# EAGLE design untitled - Kopia mask (EAGLE 7.4.0)
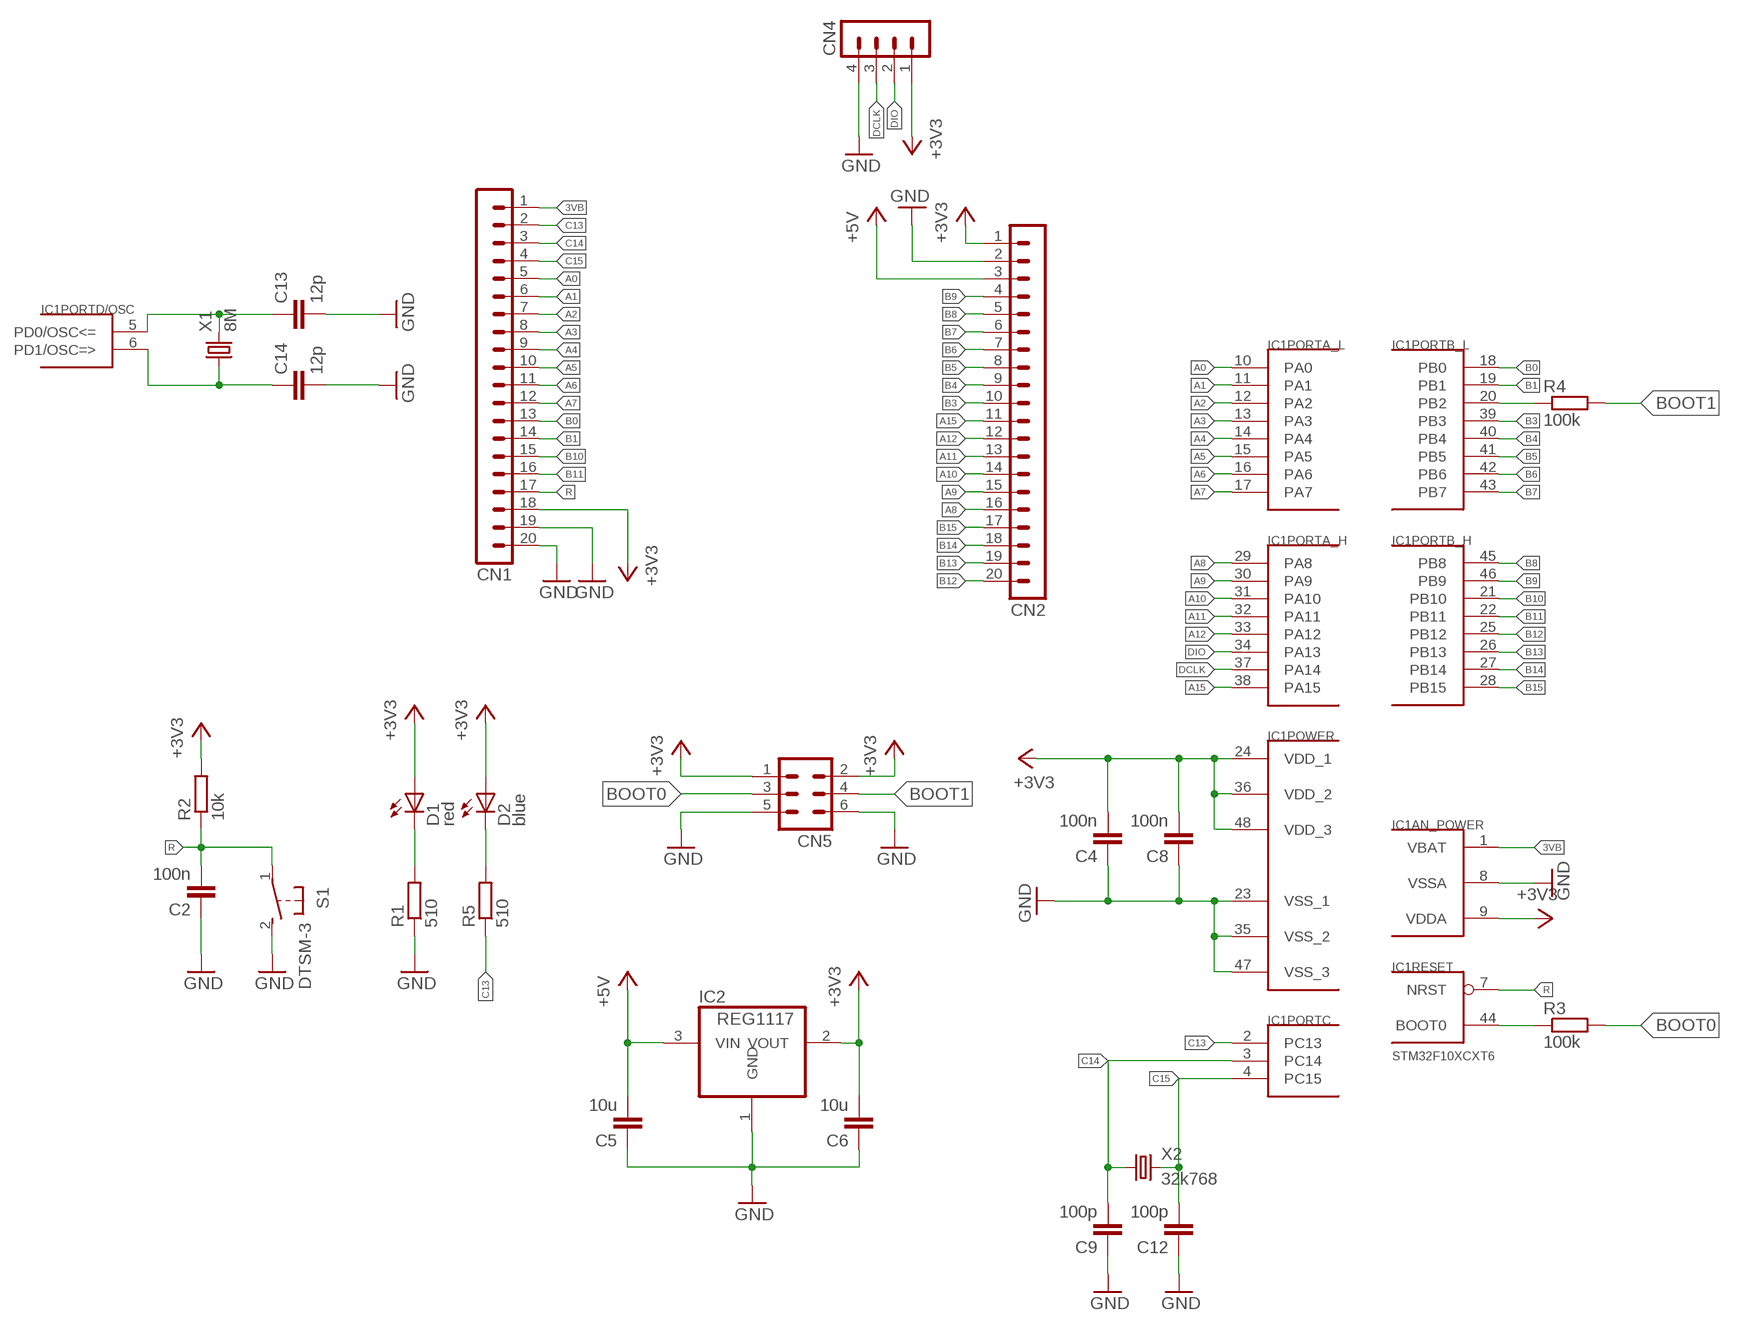
[diagram p0: schematic, sheet 1]

## Parts
C2  100n  C-EUC0805K  [C0805K]
C4  100n  C-EUC0805K  [C0805K]
C5  10u  C-EUC0805K  [C0805K]
C6  10u  C-EUC0805K  [C0805K]
C8  100n  C-EUC0805K  [C0805K]
C9  100p  C-EUC0805K  [C0805K]
C12  100p  C-EUC0805K  [C0805K]
C13  12p  C-EUC0805K  [C0805K]
C14  12p  C-EUC0805K  [C0805K]
CN1  MA20-1L  [MA20-1L]
CN2  MA20-1L  [MA20-1L]
CN4  MA04-1  [MA04-1]
CN5  MA03-2  [MA03-2]
D1  red  LEDSML0805  [SML0805]
D2  blue  LEDSML0805  [SML0805]
IC1  STM32F10XCXT6  [TQFP48]
IC2  REG1117  [SOT223]
R1  510  R-EU_M0805  [M0805]
R2  10k  R-EU_R1206  [R1206]
R3  100k  R-EU_M0805  [M0805]
R4  100k  R-EU_M0805  [M0805]
R5  510  R-EU_M0805  [M0805]
S1  DTSM-3  [DTSM-3]
X1  8M  CRYSTALHC49S  [HC49/S]
X2  32k768  CRYSTALTC26H  [TC26H]

## Nets
3VB: CN1.1 IC1.1(AN_POWER:VBAT)
+3V3: C4.2 C6.2 C8.2 CN1.18 CN2.1 CN4.1 CN5.1 CN5.2 D1.A D2.A IC1.9(AN_POWER:VDDA) IC1.24(POWER:VDD_1) IC1.36(POWER:VDD_2) IC1.48(POWER:VDD_3) IC2.2(VOUT) R2.2
+5V: C5.2 CN2.3 IC2.3(VIN)
_BOOT0: IC1.44(RESET:BOOT0) R3.1
_BOOT1: IC1.20(PORTB_L:PB2) R4.1
A0: CN1.5 IC1.10(PORTA_L:PA0)
A1: CN1.6 IC1.11(PORTA_L:PA1)
A2: CN1.7 IC1.12(PORTA_L:PA2)
A3: CN1.8 IC1.13(PORTA_L:PA3)
A4: CN1.9 IC1.14(PORTA_L:PA4)
A5: CN1.10 IC1.15(PORTA_L:PA5)
A6: CN1.11 IC1.16(PORTA_L:PA6)
A7: CN1.12 IC1.17(PORTA_L:PA7)
A8: CN2.16 IC1.29(PORTA_H:PA8)
A9: CN2.15 IC1.30(PORTA_H:PA9)
A10: CN2.14 IC1.31(PORTA_H:PA10)
A11: CN2.13 IC1.32(PORTA_H:PA11)
A12: CN2.12 IC1.33(PORTA_H:PA12)
A15: CN2.11 IC1.38(PORTA_H:PA15)
B0: CN1.13 IC1.18(PORTB_L:PB0)
B1: CN1.14 IC1.19(PORTB_L:PB1)
B3: CN2.10 IC1.39(PORTB_L:PB3)
B4: CN2.9 IC1.40(PORTB_L:PB4)
B5: CN2.8 IC1.41(PORTB_L:PB5)
B6: CN2.7 IC1.42(PORTB_L:PB6)
B7: CN2.6 IC1.43(PORTB_L:PB7)
B8: CN2.5 IC1.45(PORTB_H:PB8)
B9: CN2.4 IC1.46(PORTB_H:PB9)
B10: CN1.15 IC1.21(PORTB_H:PB10)
B11: CN1.16 IC1.22(PORTB_H:PB11)
B12: CN2.20 IC1.25(PORTB_H:PB12)
B13: CN2.19 IC1.26(PORTB_H:PB13)
B14: CN2.18 IC1.27(PORTB_H:PB14)
B15: CN2.17 IC1.28(PORTB_H:PB15)
BOOT0: CN5.3 R3.2
BOOT1: CN5.4 R4.2
C13: CN1.2 IC1.2(PORTC:PC13) R5.1
C14: C9.2 CN1.3 IC1.3(PORTC:PC14) X2.1
C15: C12.2 CN1.4 IC1.4(PORTC:PC15) X2.2
DCLK: CN4.3 IC1.37(PORTA_H:PA14)
DIO: CN4.2 IC1.34(PORTA_H:PA13)
GND: C2.1 C4.1 C5.1 C6.1 C8.1 C9.1 C12.1 C13.2 C14.2 CN1.19 CN1.20 CN2.2 CN4.4 CN5.5 CN5.6 IC1.8(AN_POWER:VSSA) IC1.23(POWER:VSS_1) IC1.35(POWER:VSS_2) IC1.47(POWER:VSS_3) IC2.1(GND) R1.1 S1.2
N$1: C13.1 IC1.5(PORTD/OSC:PD0/OSC<=) X1.2
N$2: C14.1 IC1.6(PORTD/OSC:PD1/OSC=>) X1.1
N$5: D1.C R1.2
N$6: D2.C R5.2
R: C2.2 CN1.17 IC1.7(RESET:NRST) R2.1 S1.1

## Library data of the parts
C2 C4-C6 C8 C9 C12-C14 = resistor:C-EU: CAPACITOR, European symbol
CN1 CN2 = con-lstb:MA20-1L: PIN HEADER; OC_FARNELL: unknown; OC_NEWARK: unknown
CN4 = con-lstb:MA04-1: PIN HEADER; OC_FARNELL: unknown; OC_NEWARK: unknown
CN5 = con-lstb:MA03-2: PIN HEADER; OC_FARNELL: unknown; OC_NEWARK: unknown
D1 D2 = led:LED: LED OSRAM: - CHIPLED LG R971, LG N971, LY N971, LG Q971, LY Q971, LO R971, LY R971 LH N974, LH R974 LS Q976, LO Q976, LY Q976 LO Q996 - Hyper CHIPLED LW Q18S LB Q993, LB Q99A, LB R99A - SideLED LS A670, LO A670, LY A670, LG A670, LP A670 LB A673, LV A673, LT A673, LW A673 LH A674 LY A675 LS A676, LA A676, LO A676, LY A676, LW A676 LS A679, LY A679, LG A679 - Hyper Micro SIDELED® LS Y876, LA Y876, LO Y876, LY Y876 LT Y87S - SmartLED LW L88C, LW L88S LB L89C, LB L89S, LG L890 LS L89K, LO L89K, LY L89K LS L896, LA L896, LO L896, LY L896 - TOPLED LS T670, LO T670, LY T670, LG T670, LP T670 LSG T670, LSP T670, LSY T670, LOP T670, LYG T670 LG T671, LOG T671, LSG T671 LB T673, LV T673, LT T673, LW T673 LH T674 LS T676, LA T676, LO T676, LY T676, LB T676, LH T676, LSB T676, LW T676 LB T67C, LV T67C, LT T67C, LS T67K, LO T67K, LY T67K, LW E67C LS E67B, LA E67B, LO E67B, LY E67B, LB E67C, LV E67C, LT E67C LW T67C LS T679, LY T679, LG T679 LS T770, LO T770, LY T770, LG T770, LP T770 LB T773, LV T773, LT T773, LW T773 LH T774 LS E675, LA E675, LY E675, LS T675 LS T776, LA T776, LO T776, LY T776, LB T776 LHGB T686 LT T68C, LB T68C - Hyper Mini TOPLED® LB M676 - Mini TOPLED Santana® LG M470 LS M47K, LO M47K, LY M47K Source: http://www.osram.convergy.de LUXEON: - LUMILED® LXK2-PW12-R00, LXK2-PW12-S00, LXK2-PW14-U00, LXK2-PW14-V00 LXK2-PM12-R00, LXK2-PM12-S00, LXK2-PM14-U00 LXK2-PE12-Q00, LXK2-PE12-R00, LXK2-PE12-S00, LXK2-PE14-T00, LXK2-PE14-U00 LXK2-PB12-K00, LXK2-PB12-L00, LXK2-PB12-M00, LXK2-PB14-N00, LXK2-PB14-P00, LXK2-PB14-Q00 LXK2-PR12-L00, LXK2-PR12-M00, LXK2-PR14-Q00, LXK2-PR14-R00 LXK2-PD12-Q00, LXK2-PD12-R00, LXK2-PD12-S00 LXK2-PH12-R00, LXK2-PH12-S00 LXK2-PL12-P00, LXK2-PL12-Q00, LXK2-PL12-R00 Source: www.luxeon.com KINGBRIGHT: KA-3528ASYC Source: www.kingbright.com
IC1 = stm32:STM32F10XCXT6: ST STM32F101/103 48pin LQFP
IC2 = burr-brown:REG1117: 800mA and 1A Low Dropout (LDO) Positive Regulator 1.8V, 2.5V, 2.85V, 3.3V, 5V, and Adj; MPN: REG1117; OC_FARNELL: 1097566; OC_NEWARK: 14P6981
R1-R5 = resistor:R-EU_: RESISTOR, European symbol
S1 = switch-tact:DTSM-3
X1 = crystal:CRYSTAL: CRYSTAL; OC_FARNELL: 1667008; OC_NEWARK: unknown
X2 = crystal:CRYSTAL: CRYSTAL; OC_FARNELL: unknown; OC_NEWARK: unknown

## Board
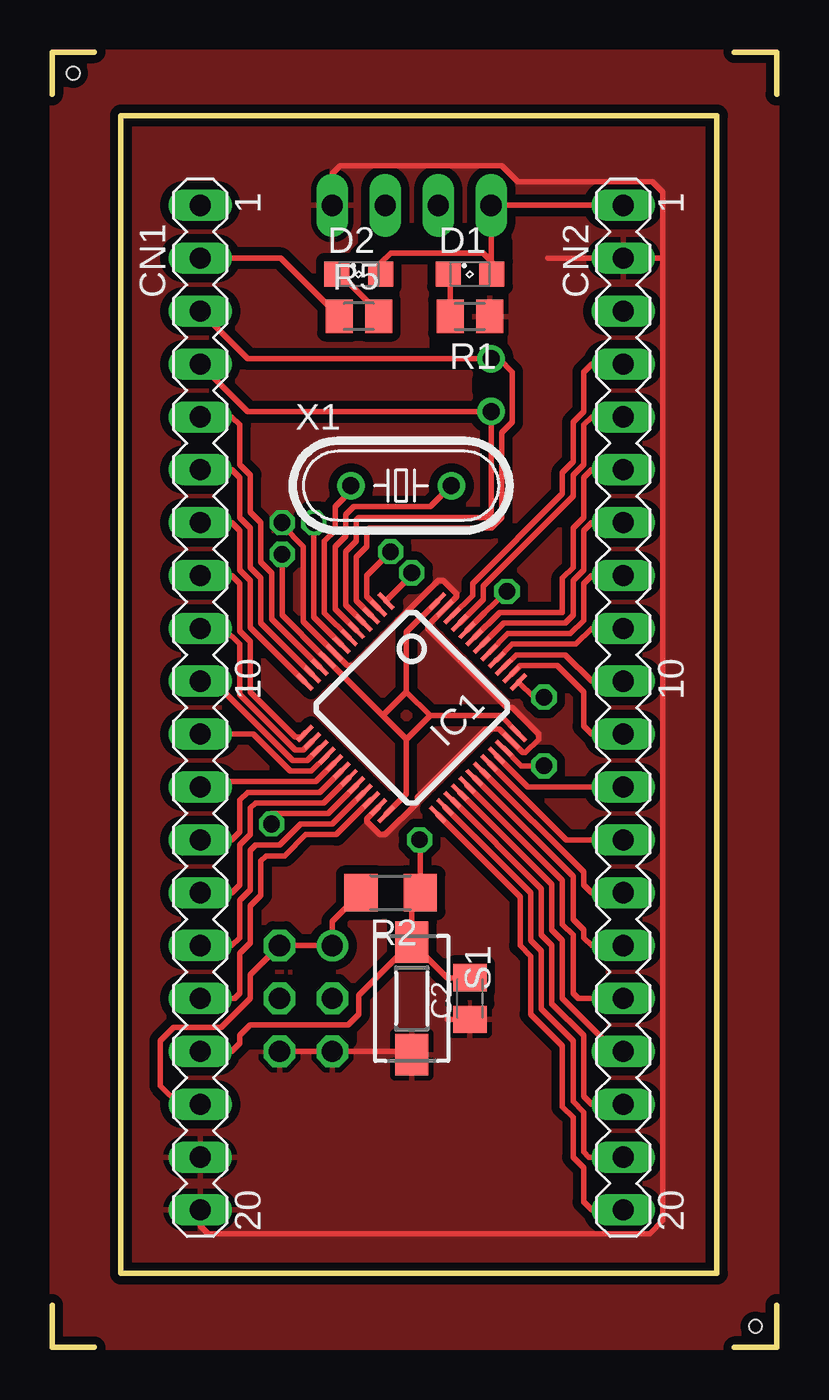
[diagram p1: board, top side]
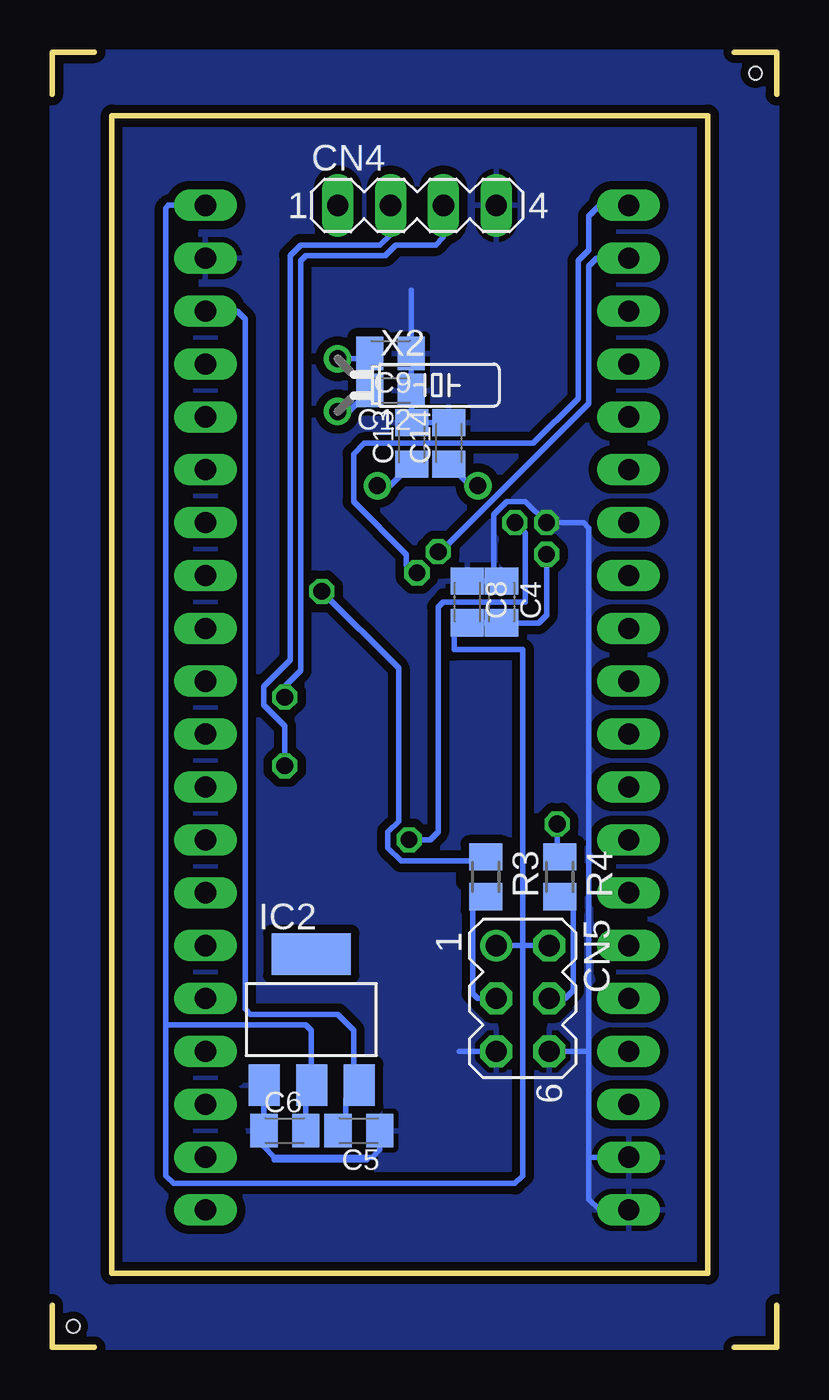
[diagram p2: board, bottom side, seen from below]

Size 34.8 x 62.23 mm. Coordinates in mm from the lower left corner, seen from the top.
Outline: 34.8,2.03 34.8,0 32.77,0
Outline: 34.8,60.2 34.8,62.23 32.77,62.23
Outline: 2.03,62.23 0,62.23 0,60.2
Outline: 0,2.03 0,0 2.03,0
Outline: 3.3,3.56 31.93,3.56 31.93,59.17 3.3,59.17 3.3,3.56
Copper layers (1*16): Top 0.035mm / dielectric 1.5mm / Bottom 0.035mm
Design rules "default *": minimum track width 10mil, minimum drill 24mil, track to track 8mil, track to pad 8mil, pad to pad 8mil, via to via 8mil, smd to smd 8mil, copper to edge 10mil, drill to drill 8mil, minimum pad ring 10mil, minimum via ring 8mil, stop-mask expansion 4mil, vias tented up to drill 0mil, thermal gap 10mil
Holes 0.6 mm at 33.78,1.02 1.02,61.21
tRestrict: area 5.8,13 to 6.1,13.2; area 8.1,18 to 8.4,18.3; area 12.2,16 to 12.4,16.3; area 8.1,20.6 to 8.4,20.8; area 8.1,23.1 to 8.4,23.4; area 8.1,25.7 to 8.4,25.9; area 8.1,33.3 to 8.4,33.5; area 8.1,35.8 to 8.4,36.1; area 8.1,38.4 to 8.4,38.6; area 8.1,40.9 to 8.4,41.1; area 8.1,43.4 to 8.4,43.7; area 26.2,46 to 26.4,46.2; 34 more areas; 4 lines
bRestrict: area 28.7,8.4 to 29,8.6; area 28.7,8.1 to 29,8.4; area 28.7,15 to 29,15.2; area 28.7,15.7 to 29,16; area 25.7,15.7 to 25.9,16; area 25.9,15.7 to 26.2,16; area 25.9,16 to 26.2,16.3; area 9.1,22.4 to 9.4,22.9; area 9.4,22.4 to 9.7,22.9; area 9.7,22.4 to 11.4,22.9; area 13,22.4 to 15,22.9; area 21.1,11.4 to 21.3,13.7; 63 more areas

### Footprints (pad centres in the part's own frame; a part is rotated, then mirrored left to right if it is on the bottom)
C0805K = smd 1.3 x 1.6: 1 -1,0; 2 1,0
MA20-1L = drill 1.016 long: 1 24.13,0; 2 21.59,0; 3 19.05,0; 4 16.51,0; 5 13.97,0; 6 11.43,0; 7 8.89,0; 8 6.35,0; 9 3.81,0; 10 1.27,0; 11 -1.27,0; 12 -3.81,0; 13 -6.35,0; 14 -8.89,0; 15 -11.43,0; 16 -13.97,0; 17 -16.51,0; 18 -19.05,0; 19 -21.59,0; 20 -24.13,0
MA04-1 = drill 1.016 long: 1 -3.81,0; 2 -1.27,0; 3 1.27,0; 4 3.81,0
MA03-2 = drill 1.016: 1 -2.54,-1.27 | drill 1.016 octagon: 2 -2.54,1.27; 3 0,-1.27; 4 0,1.27; 5 2.54,-1.27; 6 2.54,1.27
SML0805 = smd 1.2 x 1.2: A 1.05,0; C -1.05,0
TQFP48 = smd 0.2 x 1: 1 -2.75,-4.5; 2 -2.25,-4.5; 3 -1.75,-4.5; 4 -1.25,-4.5; 5 -0.75,-4.5; 6 -0.25,-4.5; 7 0.25,-4.5; 8 0.75,-4.5; 9 1.25,-4.5; 10 1.75,-4.5; 11 2.25,-4.5; 12 2.75,-4.5; 25 2.75,4.5; 26 2.25,4.5; 27 1.75,4.5; 28 1.25,4.5; 29 0.75,4.5; 30 0.25,4.5; 31 -0.25,4.5; 32 -0.75,4.5; 33 -1.25,4.5; 34 -1.75,4.5; 35 -2.25,4.5; 36 -2.75,4.5 | smd 1 x 0.2: 13 4.5,-2.75; 14 4.5,-2.25; 15 4.5,-1.75; 16 4.5,-1.25; 17 4.5,-0.75; 18 4.5,-0.25; 19 4.5,0.25; 20 4.5,0.75; 21 4.5,1.25; 22 4.5,1.75; 23 4.5,2.25; 24 4.5,2.75; 37 -4.5,2.75; 38 -4.5,2.25; 39 -4.5,1.75; 40 -4.5,1.25; 41 -4.5,0.75; 42 -4.5,0.25; 43 -4.5,-0.25; 44 -4.5,-0.75; 45 -4.5,-1.25; 46 -4.5,-1.75; 47 -4.5,-2.25; 48 -4.5,-2.75
SOT223 = smd 1.499 x 2.007: 1 -2.261,-3.15; 2 0.025,-3.15; 3 2.311,-3.15 | smd 3.81 x 2.007: 4 0,3.15
M0805 = smd 1.3 x 1.6: 1 -0.95,0; 2 0.95,0
R1206 = smd 1.6 x 1.803: 1 -1.422,0; 2 1.422,0
DTSM-3 = smd 2 x 1.6: 1 -2.7,0; 2 2.7,0
HC49/S = drill 0.813: 1 -2.413,0; 2 2.413,0
TC26H = drill 0.813: 1 -1.27,0; 2 1.27,0

### Placement (x,y rotation side)
C2  20.07,16.76 90 top
C4  13.21,35.81 270 bottom
C5  20.07,10.41 180 bottom
C6  23.62,10.41 0 bottom
C8  14.86,35.81 270 bottom
C9  18.54,47.75 180 bottom
C12  18.54,45.97 180 bottom
C13  17.53,43.43 90 bottom
C14  15.75,43.43 90 bottom
CN1  7.11,30.73 90 top
CN2  27.43,30.73 90 top
CN4  17.27,54.86 0 bottom
CN5  12.19,16.76 270 bottom
D1  20.07,51.56 0 top
D2  14.73,51.56 0 top
IC1  17.27,30.73 225 top
IC2  22.35,15.75 0 bottom
R1  20.07,49.53 180 top
R2  16.26,21.84 180 top
R3  13.97,22.61 270 bottom
R4  10.41,22.61 270 bottom
R5  14.73,49.53 0 top
S1  17.27,16.76 270 top
X1  16.76,41.4 0 top
X2  21.08,46.23 270 bottom

### Tracks (layer width: path | path; a pad name or v marks a point on that pad's centre or on a via)
3VB  (via drill 0.8)
  Top 0.254: IC1.1 17.27,37.1 v17.27,37.21
  Bottom 0.254: v17.27,37.21 17.78,37.59 17.78,38.1 20.32,40.64 20.32,42.93 19.81,43.43 11.68,43.43 9.53,45.59 9.53,52.2 9.02,52.7 9.02,54.36 8.51,54.86 CN1.1
+3V3  (via drill 0.8)
  Top 0.254: 15.88,30.36 IC1.9 12.96,33.27 12.95,33.27 11.05,35.18 v11.05,38.1 | 15.88,30.36 17.02,29.22 17.02,29.21 | IC1.48 17.02,34.37 17.02,31.5 | IC1.36 21.54,30.35 18.16,30.35 | IC1.24 17.02,26.59 17.02,29.21 | 17.02,31.5 15.88,30.36 | 17.02,31.5 18.16,30.35 | 18.16,30.35 17.02,29.21 | R2.2 13.46,20.47 CN5.1 CN5.2 9.53,17.91 9.53,16.76 8.13,15.37 5.84,15.37 5.21,14.73 5.21,12.57 6.1,11.68 CN1.18 | D2.A 15.75,51.6 15.75,52.07 16.26,52.58 20.7,52.58 21.12,52.16 D1.A 21.08,51.6 CN4.1 CN2.1
  Bottom 0.254: 12.19,19.3 12.19,33.53 15.49,33.53 15.49,34.8 14.86,34.8 | 12.19,19.3 CN5.2 | 12.7,35.31 13.19,34.81 C4.2 13.83,34.67 13.97,34.81 C8.2 14.86,34.8 | v11.05,38.1 11.05,35.18 11.43,34.8 14.86,34.8 | C6.2 22.62,12.3 IC2.2 22.35,12.62 22.35,15.24 22.61,15.49 29.34,15.49 | 29.34,15.49 29.34,54.74 29.21,54.86 CN2.1 | CN5.1 12.19,19.3 | 12.19,19.3 12.19,8.26 12.57,7.87 28.96,7.87 29.34,8.26 29.34,15.49
+5V
  Bottom 0.254: C5.2 21.07,10.43 20.7,10.79 20.7,11.94 IC2.3 20.32,12.88 20.32,15.24 21.08,16 25.27,16 25.53,16.26 25.53,49.4 25.91,49.78 CN2.3
_BOOT0  (via drill 0.8)
  Top 0.254: IC1.44 20.78,35.31 v21.84,36.32
  Bottom 0.254: v21.84,36.32 18.16,32.64 18.16,25.27 18.67,24.77 18.67,24 18.03,23.37 14.61,23.37 14.42,23.56 R3.1
_BOOT1  (via drill 0.8)
  Top 0.254: IC1.20 13.25,25.65 10.54,25.65 v10.54,25.15
  Bottom 0.254: R4.1 10.54,23.68 v10.54,25.15
A0
  Top 0.254: CN1.5 8.64,44.7 9.02,44.32 9.02,42.42 9.53,41.91 9.53,40.13 10.03,39.62 10.03,37.72 10.54,37.21 10.54,34.99 IC1.10
A1
  Top 0.254: CN1.6 8.64,42.16 9.02,41.78 9.02,39.88 9.53,39.37 9.53,37.47 10.03,36.96 10.03,34.79 IC1.11
A2
  Top 0.254: CN1.7 8.64,39.62 9.02,39.24 9.02,37.34 9.53,36.83 9.53,34.59 IC1.12
A3
  Top 0.254: CN1.8 8.64,37.08 9.02,36.7 9.02,34.42 9.53,33.91 9.53,31.5 11.68,29.34 11.97,29.34 12.15,29.51 IC1.13
A4
  Top 0.254: IC1.14 12.06,28.7 11.68,28.7 9.02,31.37 9.02,33.78 8.26,34.54 CN1.9
A5
  Top 0.254: IC1.15 12.26,28.19 11.56,28.19 7.75,32 CN1.10
A6
  Top 0.254: IC1.16 12.46,27.69 11.43,27.69 9.65,29.46 CN1.11
A7
  Top 0.254: IC1.17 12.66,27.18 7.75,27.18 7.49,26.92 CN1.12
A8
  Top 0.254: IC1.29 24.51,22.43 24.51,20.32 25.02,19.81 25.02,17.02 25.27,16.76 CN2.16
A9
  Top 0.254: IC1.30 25.02,22.63 25.02,20.57 25.53,20.07 25.53,19.68 25.91,19.3 CN2.15
A10
  Top 0.254: IC1.31 25.53,22.83 25.53,22.23 25.91,21.84 CN2.14
A11
  Top 0.254: IC1.32 24.68,24.38 CN2.13
A12
  Top 0.254: IC1.33 22.85,26.92 CN2.12
A15
  Top 0.254: IC1.38 22.49,32.77 24.26,32.77 25.53,31.5 25.53,29.85 25.91,29.46 CN2.11
B0
  Top 0.254: IC1.18 12.85,26.67 9.4,26.67 9.02,26.29 9.02,24.77 8.64,24.38 CN1.13
B1
  Top 0.254: IC1.19 13.05,26.16 9.78,26.16 9.53,25.91 9.53,24.64 9.02,24.13 9.02,22.23 8.64,21.84 CN1.14
B3
  Top 0.254: IC1.39 22.29,33.27 24.64,33.27 25.91,32 CN2.10
B4
  Top 0.254: CN2.9 25.91,34.54 25.15,33.78 22.1,33.78 IC1.40
B5
  Top 0.254: IC1.41 21.89,34.29 24.89,34.29 25.53,34.92 25.53,36.7 25.91,37.08 CN2.8
B6
  Top 0.254: IC1.42 21.69,34.8 24.64,34.8 25.02,35.18 25.02,36.83 25.53,37.34 25.53,39.24 25.91,39.62 CN2.7
B7
  Top 0.254: IC1.43 21.49,35.31 24.51,35.31 24.51,36.96 25.02,37.47 25.02,39.37 25.53,39.88 25.53,41.78 25.91,42.16 CN2.6
B8
  Top 0.254: IC1.45 20.7,35.93 20.7,36.58 25.02,40.89 25.02,41.91 25.53,42.42 25.53,44.32 25.91,44.7 CN2.5
B9
  Top 0.254: IC1.46 20.19,36.13 20.19,36.7 24.51,41.02 24.51,42.04 25.02,42.55 25.02,44.45 25.53,44.96 25.53,46.86 25.91,47.24 CN2.4
B10
  Top 0.254: IC1.21 13.45,25.15 11.94,25.15 10.92,24.13 9.78,24.13 9.53,23.88 9.53,21.97 9.02,21.46 9.02,19.68 8.64,19.3 CN1.15
B11
  Top 0.254: IC1.22 13.65,24.64 12.19,24.64 11.18,23.62 10.29,23.62 10.03,23.37 10.03,21.72 9.53,21.21 9.53,19.43 9.02,18.92 9.02,17.02 8.76,16.76 CN1.16
B12
  Top 0.254: IC1.25 22.48,21.64 22.48,19.3 22.99,18.8 22.99,16 24.51,14.48 24.51,11.56 25.02,11.05 25.02,9.14 25.53,8.64 25.53,6.98 25.91,6.6 CN2.20
B13
  Top 0.254: IC1.26 22.99,21.84 22.99,19.56 23.5,19.05 23.5,16.26 25.02,14.73 25.02,11.81 25.53,11.3 25.53,9.4 25.78,9.14 CN2.19
B14
  Top 0.254: IC1.27 23.5,22.04 23.5,19.81 24,19.3 24,16.51 25.53,14.99 25.53,12.07 25.91,11.68 CN2.18
B15
  Top 0.254: IC1.28 24,22.23 24,20.07 24.51,19.56 24.51,16.76 27.05,14.22 CN2.17
BOOT0
  Bottom 0.254: R3.2 14.61,21.02 14.61,17.02 14.35,16.76 CN5.3
BOOT1
  Bottom 0.254: CN5.4 10.16,16.76 9.78,17.14 9.78,21.21 10.23,21.66 R4.2
C13  (via drill 0.8)
  Top 0.254: IC1.2 15.11,36.08 15.11,37.08 v16.26,38.23 | R5.1 10.99,52.32 CN1.2
  Bottom 0.254: v16.26,38.23 16.13,38.23 9.02,45.34 9.02,51.94 8.64,52.32 CN1.2
C14
  Top 0.254: IC1.3 14.61,35.88 14.61,37.97 15.11,38.48 15.11,39.24 15.24,39.37 21.08,39.37 21.59,39.88 21.59,43.94 22.1,44.45 22.1,46.86 21.46,47.5 X2.1 9.4,47.5 CN1.3
  Bottom 0.254: C9.2 19.8,47.5 X2.1
C15
  Top 0.254: IC1.4 14.1,35.68 14.1,38.23 14.61,38.73 14.61,39.75 14.73,39.88 20.83,39.88 21.08,40.13 X2.2 9.4,44.96 CN1.4
  Bottom 0.254: C12.2 20.56,44.96 X2.2
DCLK  (via drill 0.8)
  Top 0.254: IC1.37 23.13,31.24 v23.62,31.24
  Bottom 0.254: v23.62,31.24 23.62,31.75 22.86,32.51 22.86,52.2 22.61,52.45 18.8,52.45 18.29,52.96 16.38,52.96 16,53.34 CN4.3
DIO  (via drill 0.8)
  Top 0.254: IC1.34 22.54,27.94 v23.62,27.94
  Bottom 0.254: CN4.2 18.54,53.47 19.05,52.96 22.86,52.96 23.37,52.45 23.37,33.02 24.64,31.75 24.64,30.86 23.62,29.85 v23.62,27.94
GND  (via drill 0.8)
  Top 0.254: IC1.23 15.11,25.39 15.11,25.27 15.75,24.64 16,24.64 17.53,26.16 17.53,26.42 20.83,29.72 21.47,29.72 IC1.35 22.61,28.57 22.73,28.57 23.37,29.21 23.37,29.46 22.1,30.73 21.84,30.73 18.03,34.54 18.03,34.68 IC1.47 19.43,36.08 19.43,36.19 18.8,36.83 18.54,36.83 14.48,32.77 14.18,32.77 IC1.8 12.07,34.88 12.07,38.48 11.05,39.5 v11.05,39.62 | CN5.6 CN5.5 16.64,14.22 16.8,14.06 S1.2 | 18.97,15.76 C2.1 | 23.81,52.32 CN2.2 29.34,52.32 | CN4.4 13.46,56.39 13.84,56.77 21.59,56.77 22.35,56.01 28.83,56.01 29.34,55.5 29.34,52.32 | 29.34,52.32 29.34,6.1 28.7,5.46 7.49,5.46 7.11,5.84 CN1.20
  Bottom 0.254: 9.02,14.22 9.02,39.37 9.27,39.62 v11.05,39.62 12.07,40.64 12.95,40.64 13.59,40 13.59,37.34 13.21,36.96 C4.1 | 9.02,14.22 CN5.6 | C4.1 13.86,36.7 13.97,36.81 C8.1 | 12.72,36.81 C4.1 | 9.02,14.22 9.02,9.14 | 9.02,9.14 CN1.19 | CN1.20 8.51,6.6 9.02,7.11 9.02,9.14 | C14.2 C13.2 17.53,45.96 C12.1 C9.1 17.54,50.78 | 15.26,14.22 CN5.5 | C6.1 IC2.1 24.64,12.57 24.64,9.65 24.13,9.14 19.43,9.14 19.07,9.51 C5.1
  pour Top (isolate 0.406): 31.5,4.06 3.56,4.06 3.56,58.93 31.5,58.93
  pour Bottom (isolate 0.406): 31.5,4.06 3.81,4.06 3.81,58.67 31.5,58.67
N$1
  Top 0.254: IC1.5 13.59,35.48 13.59,38.48 14.1,38.99 14.1,40 14.48,40.39 18.16,40.39 X1.2
  Bottom 0.254: C13.1 18.56,41.4 X1.2
N$2
  Top 0.254: IC1.6 13.08,35.28 13.08,38.73 13.59,39.24 13.59,40.39 14.35,41.15 X1.1
  Bottom 0.254: C14.1 14.72,41.4 X1.1
N$3
  pour Bottom (isolate 0.406): 34.8,0 0,0 0,62.23 34.8,62.23
N$4
  Bottom 0.254: 24.13,9.02 19.69,9.02
N$5
  Top 0.254: D1.C 19.12,51.46 R1.2
N$6
  Top 0.254: R5.2 15.68,49.72 14.1,51.31 13.94,51.31 D2.C
OUT
  pour Top (isolate 0.406): 34.8,0 0,0 0,62.23 34.8,62.23
R  (via drill 0.8)
  Top 0.254: v17.65,24.38 17.68,24.23 R2.1 17.27,21.44 S1.1 | IC1.7 12.57,35.08 v12.57,39.62 | S1.1 14.73,16.92 14.73,16 14.22,15.49 9.53,15.49 9.02,14.99 9.02,14.61 8.64,14.22 CN1.17 | S1.1 18.97,17.76 C2.2
  Bottom 0.254: v17.65,24.38 16.64,24.38 16.26,24.77 16.26,35.56 16,35.81 12.07,35.81 12.07,39.12 v12.57,39.62

### Text on the board
boardDescription: GND | DCLK | DIO | 3V3 | 3VB | 3V3 | C13 | GND | C14 | 5V | C15 | B9 | A0 | B8 | A1 | B7 | A2 | B6 | A3 | B5 | A4 | B4 | A5 | B3 | A6 | A15 | A7 | A12 | B0 | A11 | B1 | A10 | B10 | A9 | B11 | A8 | R | B15 | B14 | 3V3 | GND | B13 | B12 | GND
tBoardDescriptiom: 3V3 | 3V3 | BT1 | BT0 | GND | GND | STM 32f103 / Mini board / ⓒ Sh4DoV